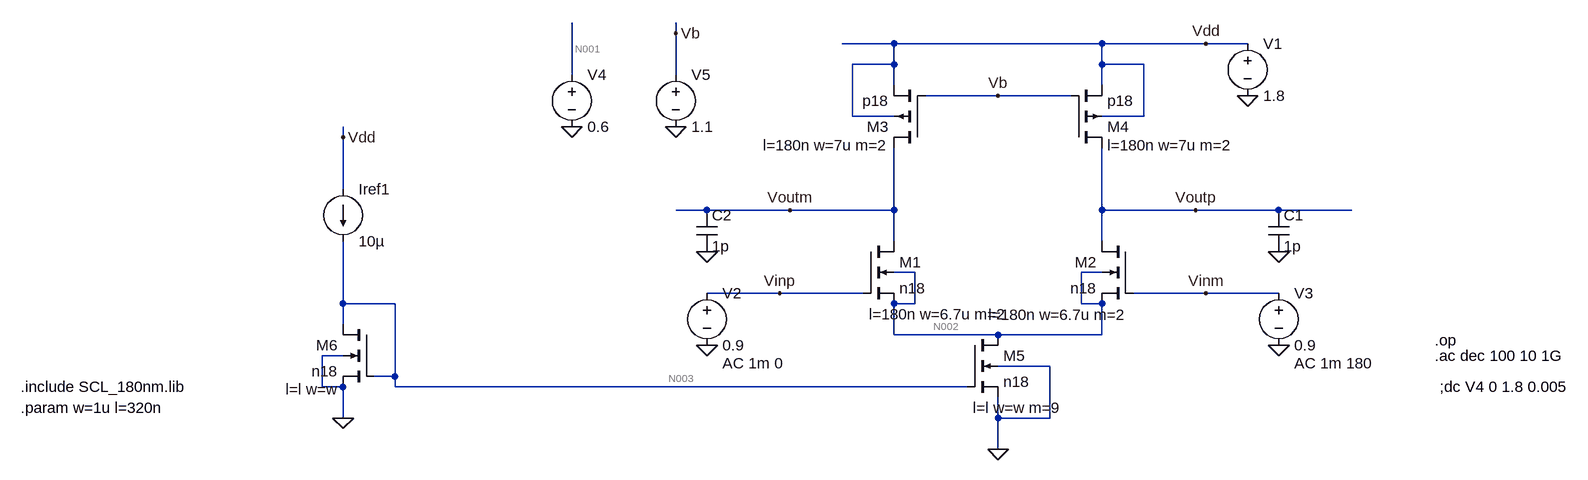
[diagram p0: schematic diff_5T_OTA_180.asc]
diff_5T_OTA_180.asc, the LTspice schematic file:
Version 4
SHEET 1 1188 804
WIRE -224 -160 -224 -176
WIRE 112 -144 32 -144
WIRE 432 -144 112 -144
WIRE 592 -144 432 -144
WIRE 656 -144 592 -144
WIRE 112 -112 112 -144
WIRE 112 -112 48 -112
WIRE 432 -112 432 -144
WIRE 496 -112 432 -112
WIRE -384 -96 -384 -176
WIRE -224 -96 -224 -160
WIRE 112 -80 112 -112
WIRE 432 -80 432 -112
WIRE 272 -64 160 -64
WIRE 384 -64 272 -64
WIRE 48 -32 48 -112
WIRE 112 -32 48 -32
WIRE 496 -32 496 -112
WIRE 496 -32 432 -32
WIRE -736 0 -736 -16
WIRE -736 80 -736 0
WIRE -176 112 -224 112
WIRE -48 112 -176 112
WIRE 112 112 112 16
WIRE 112 112 -48 112
WIRE 432 112 432 16
WIRE 576 112 432 112
WIRE 704 112 576 112
WIRE 816 112 704 112
WIRE 112 160 112 112
WIRE 432 160 432 112
WIRE 144 208 112 208
WIRE 432 208 400 208
WIRE -64 240 -176 240
WIRE 64 240 -64 240
WIRE 592 240 480 240
WIRE 704 240 592 240
WIRE -736 256 -736 160
WIRE -656 256 -736 256
WIRE 144 256 144 208
WIRE 144 256 112 256
WIRE 400 256 400 208
WIRE 432 256 400 256
WIRE -736 288 -736 256
WIRE 112 304 112 256
WIRE 272 304 112 304
WIRE 432 304 432 256
WIRE 432 304 272 304
WIRE -736 336 -768 336
WIRE 352 352 272 352
WIRE -656 368 -656 256
WIRE -656 368 -688 368
WIRE -768 384 -768 336
WIRE -736 384 -768 384
WIRE -656 384 -656 368
WIRE 224 384 -656 384
WIRE -736 432 -736 384
WIRE 272 432 272 400
WIRE 352 432 352 352
WIRE 352 432 272 432
WIRE 272 480 272 432
FLAG 656 -64 0
FLAG 704 320 0
FLAG -176 320 0
FLAG 592 -144 Vdd
FLAG -64 240 Vinp
FLAG 592 240 Vinm
FLAG 576 112 Voutp
FLAG -48 112 Voutm
FLAG 704 176 0
FLAG -176 176 0
FLAG 272 480 0
FLAG 272 -64 Vb
FLAG -384 -16 0
FLAG -224 -16 0
FLAG -224 -160 Vb
FLAG -736 432 0
FLAG -736 0 Vdd
SYMBOL nmos4 64 160 R0
WINDOW 123 9 112 Left 2
SYMATTR Value2 l=180n w=6.7u m=2
SYMATTR InstName M1
SYMATTR Value n18
SYMBOL nmos4 480 160 M0
WINDOW 123 9 113 Left 2
SYMATTR Value2 l=180n w=6.7u m=2
SYMATTR InstName M2
SYMATTR Value n18
SYMBOL voltage 656 -160 R0
WINDOW 123 0 0 Left 0
WINDOW 39 0 0 Left 0
SYMATTR InstName V1
SYMATTR Value 1.8
SYMBOL voltage -176 224 R0
WINDOW 123 24 124 Left 2
WINDOW 39 0 0 Left 0
SYMATTR Value2 AC 1m 0
SYMATTR InstName V2
SYMATTR Value 0.9
SYMBOL voltage 704 224 R0
WINDOW 123 24 124 Left 2
WINDOW 39 0 0 Left 0
SYMATTR Value2 AC 1m 180
SYMATTR InstName V3
SYMATTR Value 0.9
SYMBOL cap 688 112 R0
SYMATTR InstName C1
SYMATTR Value 1p
SYMBOL cap -192 112 R0
SYMATTR InstName C2
SYMATTR Value 1p
SYMBOL pmos4 160 16 R180
WINDOW 123 56 4 Left 2
SYMATTR Value2 l=180n w=7u m=2
SYMATTR InstName M3
SYMATTR Value p18
SYMBOL pmos4 384 16 M180
WINDOW 123 56 4 Left 2
SYMATTR Value2 l=180n w=7u m=2
SYMATTR InstName M4
SYMATTR Value p18
SYMBOL nmos4 224 304 R0
WINDOW 123 9 112 Left 2
SYMATTR Value2 l=l w=w m=9
SYMATTR InstName M5
SYMATTR Value n18
SYMBOL voltage -384 -112 R0
WINDOW 123 0 0 Left 0
WINDOW 39 0 0 Left 0
SYMATTR InstName V4
SYMATTR Value 0.6
SYMBOL voltage -224 -112 R0
WINDOW 123 0 0 Left 0
WINDOW 39 0 0 Left 0
SYMATTR InstName V5
SYMATTR Value 1.1
SYMBOL nmos4 -688 288 M0
WINDOW 123 56 100 Left 2
SYMATTR Value2 l=l w=w
SYMATTR InstName M6
SYMATTR Value n18
SYMBOL current -736 80 R0
WINDOW 123 0 0 Left 0
WINDOW 39 0 0 Left 0
SYMATTR InstName Iref1
SYMATTR Value 10µ
TEXT -1232 384 Left 2 !.include SCL_180nm.lib
TEXT 944 336 Left 2 !.ac dec 100 10 1G
TEXT 944 312 Left 2 !.op
TEXT 952 384 Left 2 !;dc V4 0 1.8 0.005
TEXT -1232 416 Left 2 !.param w=1u l=320n

The netlist it stands for:
* diff_5T_OTA_180.asc
M1 Voutm Vinp N002 N002 n18 l=180n w=6.7u m=2
M2 Voutp Vinm N002 N002 n18 l=180n w=6.7u m=2
V1 Vdd 0 1.8
V2 Vinp 0 0.9 AC 1m 0
V3 Vinm 0 0.9 AC 1m 180
C1 Voutp 0 1p
C2 Voutm 0 1p
M3 Voutm Vb Vdd Vdd p18 l=180n w=7u m=2
M4 Voutp Vb Vdd Vdd p18 l=180n w=7u m=2
M5 N002 N003 0 0 n18 l=l w=w m=9
V4 N001 0 0.6
V5 Vb 0 1.1
M6 N003 N003 0 0 n18 l=l w=w
Iref1 Vdd N003 10µ
.model NMOS NMOS
.model PMOS PMOS
.lib standard.mos
.include SCL_180nm.lib
.ac dec 100 10 1G
.op
;dc V4 0 1.8 0.005
.param w=1u l=320n
.backanno
.end

* Results of the author's LTspice run, read from the files saved beside the schematic
* Operating Point, zero values left out:
*   V(voutm) = 528 mV
*   V(vinp) = 900 mV
*   V(n002) = 322.8 mV
*   V(voutp) = 528 mV
*   V(vinm) = 900 mV
*   V(vdd) = 1.8 V
*   V(vb) = 1.1 V
*   V(n003) = 630.1 mV
*   V(n001) = 600 mV
*   Id(M4) = -42.62 µA
*   Ib(M4) = 2.564 pA
*   Is(M4) = 42.62 µA
*   Id(M3) = -42.62 µA
*   Ib(M3) = 2.564 pA
*   Is(M3) = 42.62 µA
*   Id(M6) = 10 µA
*   Is(M6) = -10 µA
*   Id(M5) = 85.24 µA
*   Ib(M5) = -2.996 pA
*   Is(M5) = -85.24 µA
*   Id(M2) = 42.62 µA
*   Is(M2) = -42.62 µA
*   Id(M1) = 42.62 µA
*   Is(M1) = -42.62 µA
*   I(Iref1) = 10 µA
*   I(V1) = -95.24 µA
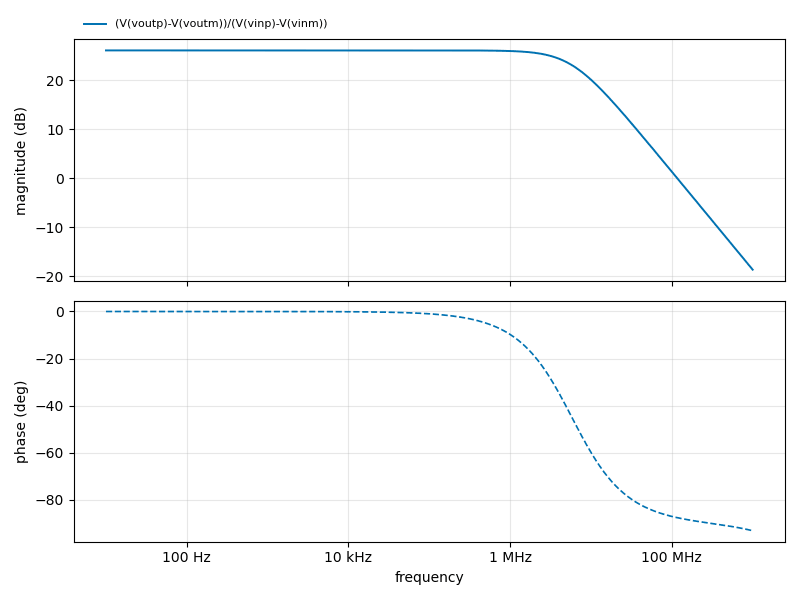
[diagram p1: AC Analysis of diff_5T_OTA_180.asc, plotted from the saved traces]
* AC Analysis, 1 run:
*   (V(voutp)-V(voutm))/(V(vinp)-V(vinm)): 26.08 dB at 10 Hz, -18.61 dB at 1 GHz, peak 26.08 dB at 10 Hz, 3 dB below the peak at 5.816 MHz